# EAGLE schematic Regulator_Switching_MCP16323 (EAGLE 6.5.0)
Switching RegulatorL MCP16323 MCP16323 <http://ww1.microchip.com/downloads/en/DeviceDoc/22284A.pdf> Includes all capacitors and inductors required. Input voltages between 6 and 18. If using V_BATT or V_SUPP, ensure the voltage does not fall out of these limits. Available output voltages are 0.9, 1.5, 1.8, 2.5, 3.3, 5 volts Rated to 3A.
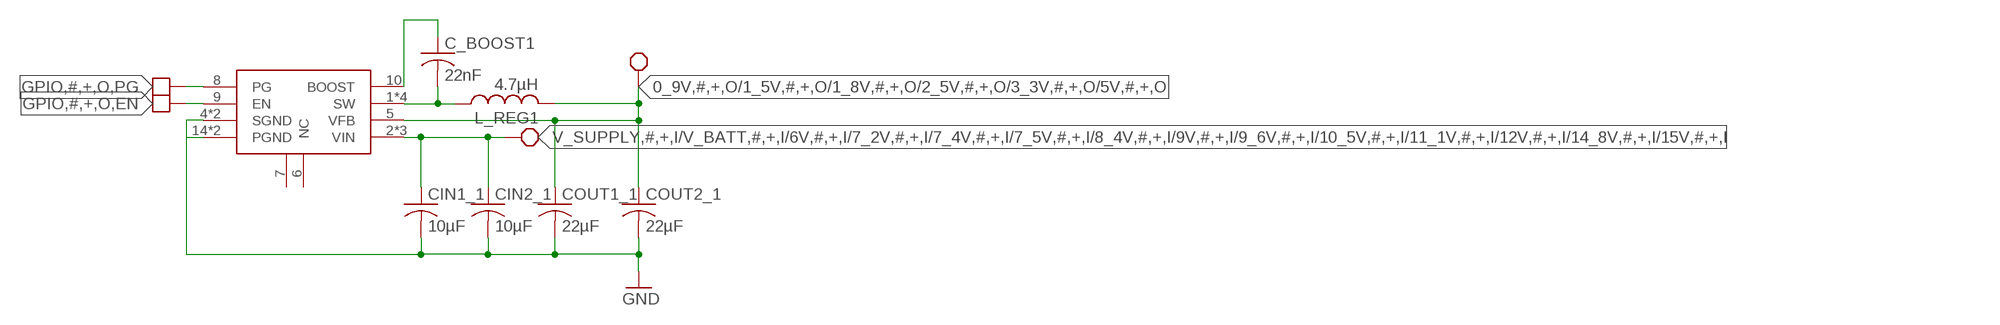
[diagram p0: schematic, sheet 1]

## Parts
C_BOOST1  22nF  C-USC0603  [C0603]
CIN1_1  10µF  C-USC0805  [C0805]
CIN2_1  10µF  C-USC0805  [C0805]
COUT1_1  22µF  C-USC0603  [C0603]
COUT2_1  22µF  C-USC0603  [C0603]
L_REG1  4.7µH  VLC5045  [VLC5045]
SW_REG1  MCP16323  [QFN16]

## Nets
0_9V,#,+,O/1_5V,#,+,O/1_8V,#,+,O/2_5V,#,+,O/3_3V,#,+,O/5V,#,+,O: COUT1_1.1 COUT2_1.1 L_REG1.2 SW_REG1.5(VFB) ; supply symbol labelled BLOCK_REQUIREMENT
BOOST1: C_BOOST1.1 SW_REG1.10(BOOST)
GND: CIN1_1.2 CIN2_1.2 COUT1_1.2 COUT2_1.2 SW_REG1.4(SGND) SW_REG1.14(PGND) SW_REG1.15(PGND) SW_REG1.TH(SGND)
GPIO,#,+,O,EN: SW_REG1.9(EN) ; supply symbol labelled BLOCK_OPTIONAL
GPIO,#,+,O,PG: SW_REG1.8(PG) ; supply symbol labelled BLOCK_OPTIONAL
SW1: C_BOOST1.2 L_REG1.1 SW_REG1.1(SW) SW_REG1.12(SW) SW_REG1.13(SW) SW_REG1.16(SW)
V_SUPPLY,#,+,I/V_BATT,#,+,I/6V,#,+,I/7_2V,#,+,I/7_4V,#,+,I/7_5V,#,+,I/8_4V,#,+,I/9V,#,+,I/9_6V,#,+,I/10_5V,#,+,I/11_1V,#,+,I/12V,#,+,I/14_8V,#,+,I/15V,#,+,I: CIN1_1.1 CIN2_1.1 SW_REG1.2(VIN) SW_REG1.3(VIN) SW_REG1.11(VIN) ; supply symbol labelled BLOCK_REQUIREMENT
Unconnected: SW_REG1.6(NC) SW_REG1.7(NC2)

## Library data of the parts
C_BOOST1 CIN1_1 CIN2_1 COUT1_1 COUT2_1 = resistor:C-US: CAPACITOR, American symbol
L_REG1 = piccoli:VLC5045
SW_REG1 = piccoli:MCP16323

## Net classes
4 xxwide: width 0.203 mm